# EasyEDA Pro project EverythingBoard.epro

# Schematic Schematic1
Board Name: Board1; Create Date: 2025-08-05; Page Name: P1; Project Name: "Everything Board" [YTK-DE1]; Schematic Name: Schematic1; Update Date: 2025-08-04; Company: EasyEDA.com; Page Size: A4; Version: V1.0
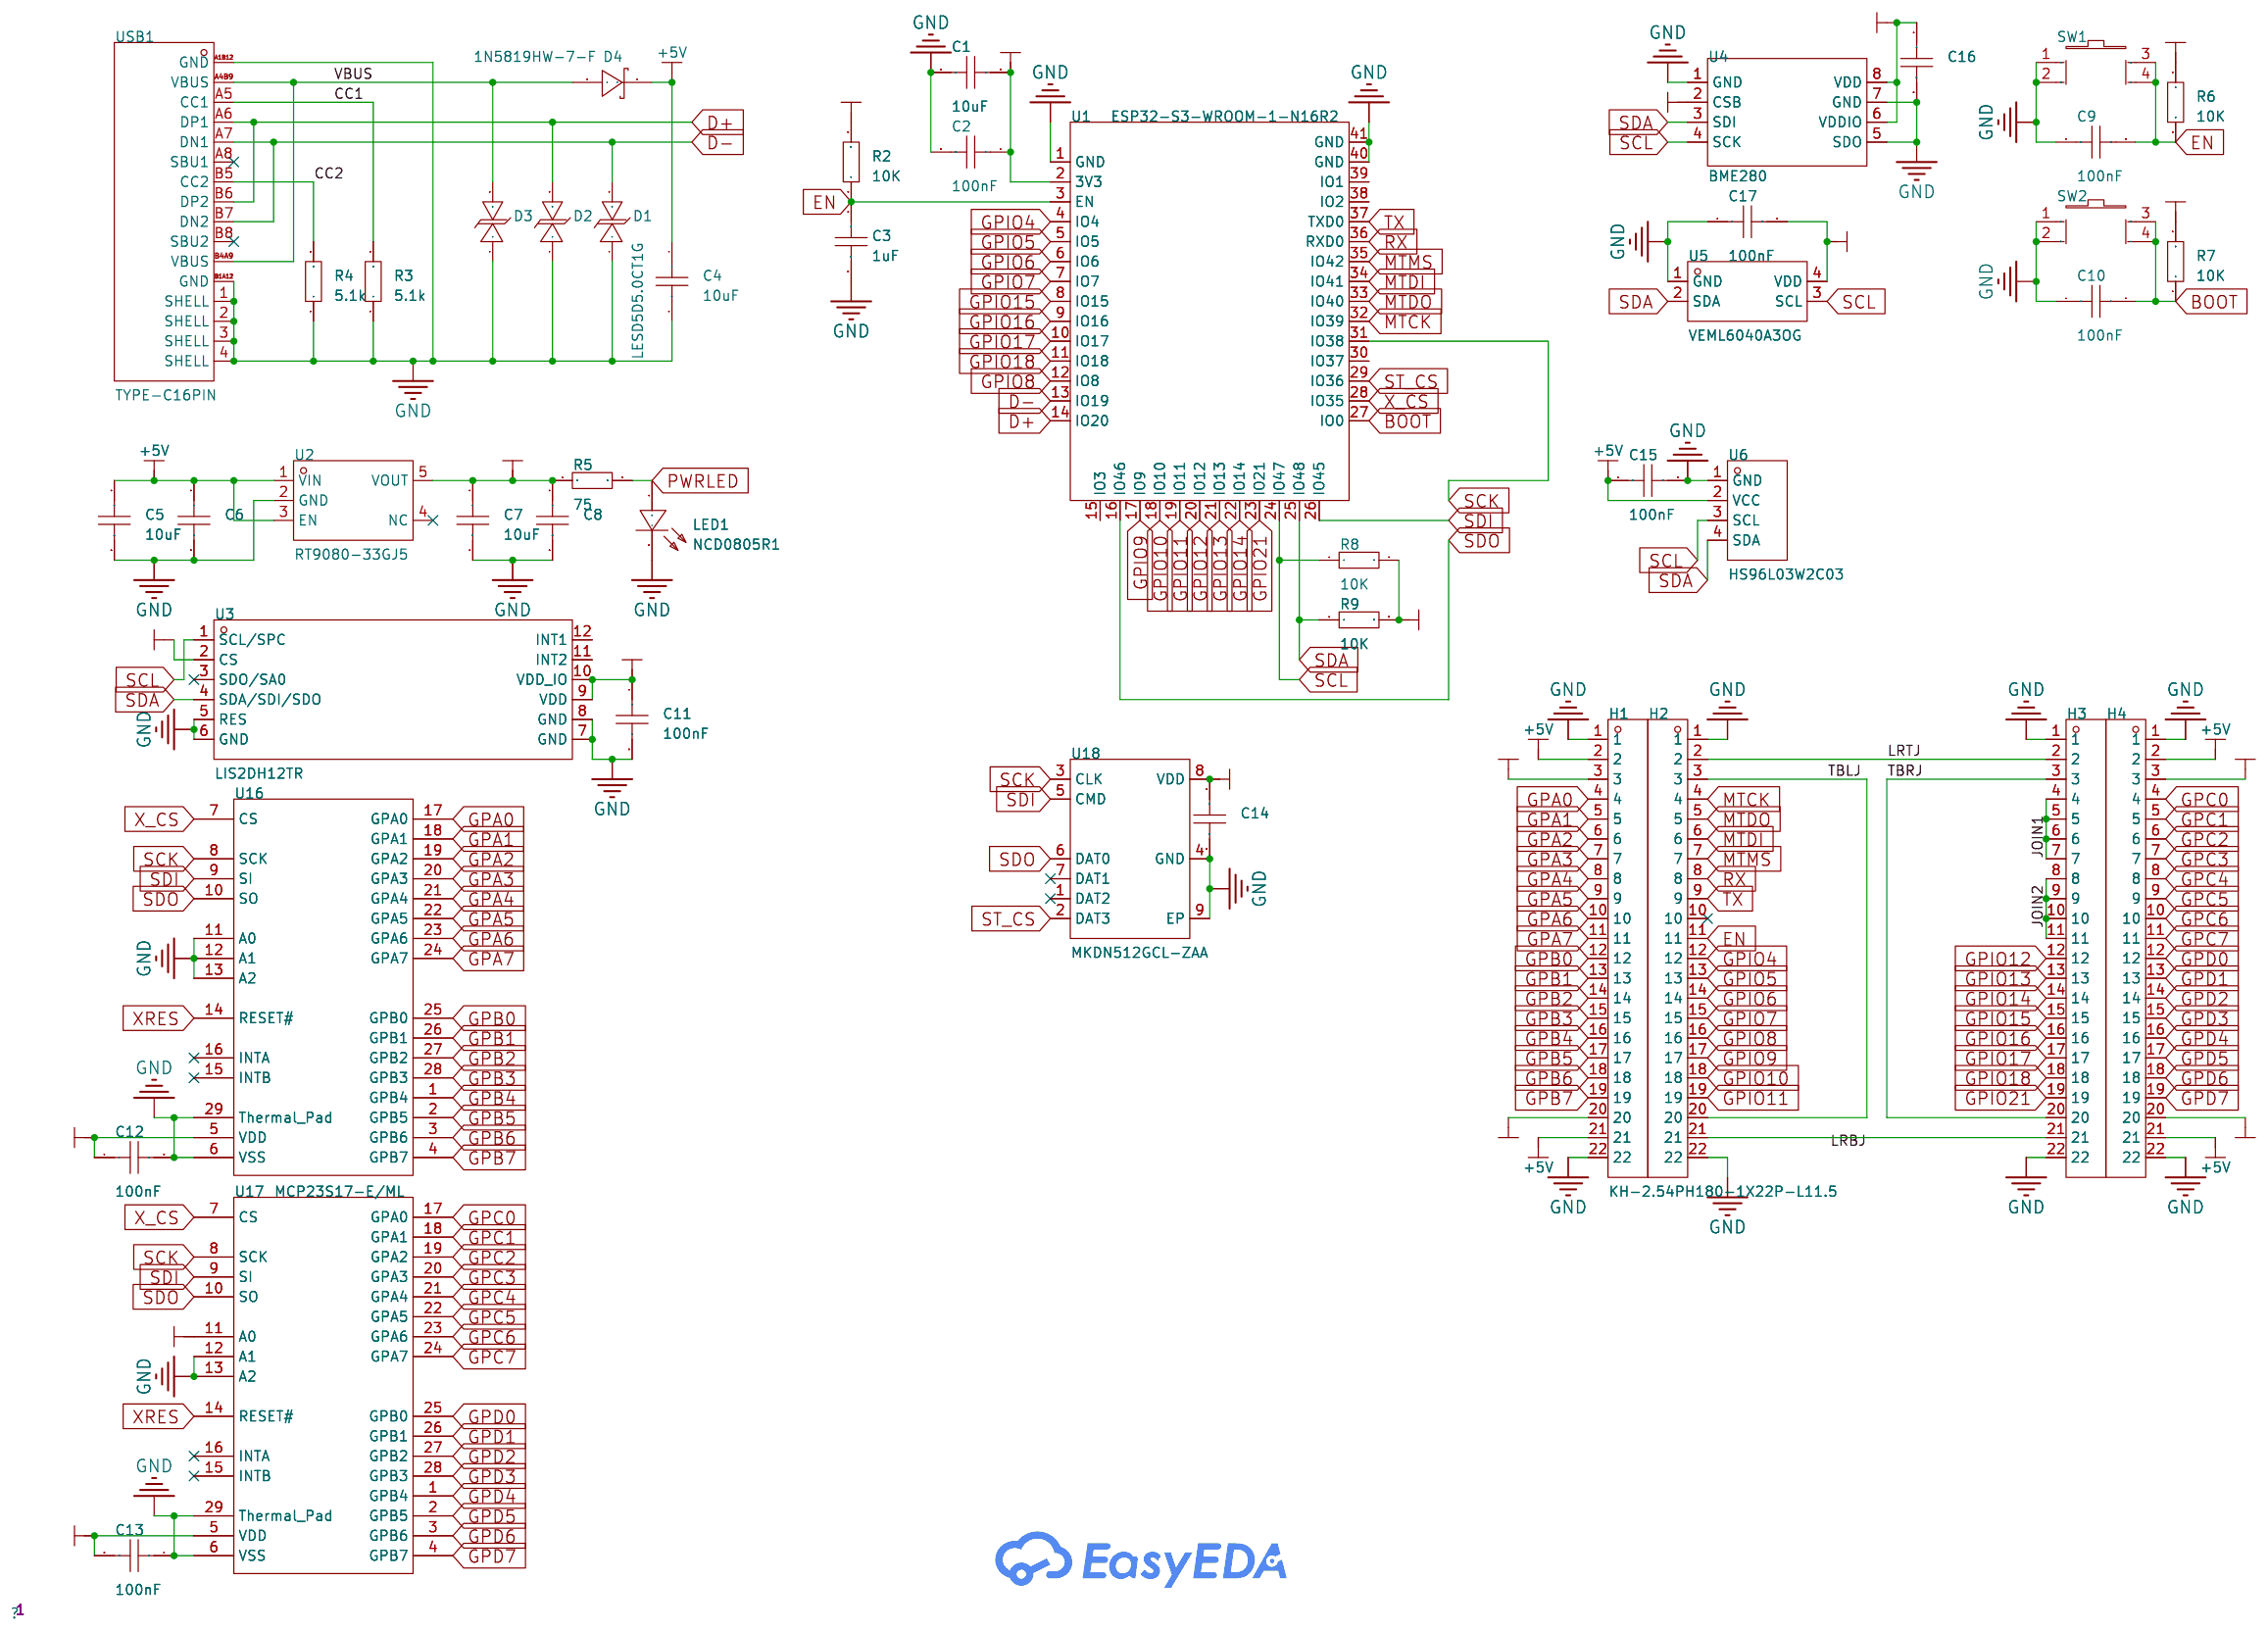
[diagram p0: schematic sheet]

## Parts
C1  10uF  [C0603]
C2  100nF  [C0603]
C3  1uF  [C0603]
C4  10uF  [C0603]
C5  10uF  [C0603]
C6  100nF  [C0603]
C7  10uF  [C0603]
C8  100nF  [C0603]
C9  100nF  [C0603]
C10  100nF  [C0603]
C11  100nF  [C0603]
C12  100nF  [C0603]
C13  100nF  [C0603]
C14  100nF  [C0603]
C15  100nF  [C0603]
C16  100nF  [C0603]
C17  100nF  [C0603]
D1  LESD5D5.0CT1G  [SOD-523_L1.2-W0.8-LS1.6-BI]
D2  LESD5D5.0CT1G  [SOD-523_L1.2-W0.8-LS1.6-BI]
D3  LESD5D5.0CT1G  [SOD-523_L1.2-W0.8-LS1.6-BI]
D4  1N5819HW-7-F  [SOD-123_L2.7-W1.6-LS3.7-RD]
H1  KH-2.54PH180-1X22P-L11.5  [HDR-TH_22P-P2.54-V-M]
H2  KH-2.54PH180-1X22P-L11.5  [HDR-TH_22P-P2.54-V-M]
H3  KH-2.54PH180-1X22P-L11.5  [HDR-TH_22P-P2.54-V-M]
H4  KH-2.54PH180-1X22P-L11.5  [HDR-TH_22P-P2.54-V-M]
LED1  NCD0805R1  [LED0805-R-RD]
R2  10K  [R0603]
R3  5.1k  [R0603]
R4  5.1k  [R0603]
R5  75  [R0603]
R6  10K  [R0603]
R7  10K  [R0603]
R8  10K  [R0603]
R9  10K  [R0603]
SW1  PTS810SJG250SMTRLFS  [SW-SMD_4P_PTS810SJM250SMTRLFS]
SW2  PTS810SJG250SMTRLFS  [SW-SMD_4P_PTS810SJM250SMTRLFS]
U1  ESP32-S3-WROOM-1-N16R2  [WIRELM-SMD_ESP32-S3-WROOM-1]
U2  RT9080-33GJ5  [TSOT-23-5_L2.9-W1.6-P0.95-LS2.8-BL]
U3  LIS2DH12TR  [LGA-12_L2.0-W2.0-P0.50-BL]
U4  BME280  [LGA-8_BME280_BL]
U5  VEML6040A3OG  [SENSOR_SMD_VEML6040A3OG]
U6  HS96L03W2C03  [OLED-TH_L27.8-W27.2-P2.54_C9900033791]
U16  MCP23S17-E/ML  [QFN-28_L6.0-W6.0-P0.65-BL-EP]
U17  MCP23S17-E/ML  [QFN-28_L6.0-W6.0-P0.65-BL-EP]
U18  MKDN512GCL-ZAA  [LGA-16_L12.5-W9.0-P1.27-TL-EP]
USB1  TYPE-C16PIN  [USB-C-SMD_TYPE-C16PIN]

## Library data of the parts
C1-C17 = CAP_0603: Supplier Footprint: 0603
D1-D3 = LESD5D5.0CT1G_C5199850: Supplier Part: C5199850; Manufacturer: UMW(友台半导体); Supplier Footprint: SOD-523; JLCPCB Part Class: Extended Part; Datasheet: https://atta.szlcsc.com/upload/public/pdf/source/20231109/3A3F4A5EA6FBA8B622F70BA286F4E0C0.pdf; Supplier: LCSC
D4 = 1N5819HW-7-F: Forward Voltage (Vf@If):450mV@1A Reverse Voltage (Vr):40V Rectified Current:1A Reverse Leakage Current (Ir):1mA@40V; LCSC Part Name: 电压:40V 电流:1A; Supplier Part: C82544; Manufacturer: DIODES(美台); Supplier Footprint: SOD-123; JLCPCB Part Class: Extended Part; Datasheet: https://atta.szlcsc.com/upload/public/pdf/source/20161024/1477288459223.pdf; Supplier: LCSC; Forward Voltage (Vf@If): 450mV@1A; Reverse Voltage (Vr): 40V; Rectified Current: 1A; Reverse Leakage Current (Ir): 1mA@40V
H1-H4 = KH-2.54PH180-1X22P-L11.5: Pin Structure:1x22P Pitch:2.54mm Number of Rows:Single Row; LCSC Part Name: 1x22P 间距:2.54mm; Supplier Part: C20610289; Manufacturer: kinghelm(金航标); Supplier Footprint: 插件,P=2.54mm; JLCPCB Part Class: Extended Part; Datasheet: https://atta.szlcsc.com/upload/public/pdf/source/20240117/4D3622A7E89961A992C721F36FCFC9FD.pdf; Supplier: LCSC; Pin Structure: 1x22P; Pitch: 2.54mm; Number of Rows: Single Row
LED1 = NCD0805R1_C84256: Lamp Holder Type:- Emitted Color:Red Forward Voltage (VF):1.6V~2.6V Forward Voltage (VF):1.6V~2.6V Power Dissipation:65mW Forward Current:20mA Dominant Wavelength:615nm~630nm Dominant Wavelength:615nm~630nm Peak Wavelength:- Diode Configuration:独立二极管 Lens; Supplier Part: C84256; Manufacturer: 国星光电; Supplier Footprint: 0805; JLCPCB Part Class: Basic Part; Datasheet: https://atta.szlcsc.com/upload/public/pdf/source/20200820/C84256_F0A75A43B3EAD75808600A0514C76B99.pdf; Supplier: LCSC; Emitted Color: Red; Forward Voltage (VF): 1.6V~2.6V; Power Dissipation: 65mW; Forward Current: 20mA; Dominant Wavelength: 615nm~630nm; Diode Configuration: 独立二极管; Lens Color: 无色透明透镜; Luminous Intensity: 67mcd~195mcd; Viewing Angle: 130°; Operating Temperature: -30℃~+85℃
R2-R9 = Res_0603: Supplier Footprint: 0603
SW1 SW2 = PTS810SJG250SMTRLFS: Circuit:SPST Actuator Style:Round Button Operating Force:400gf Mounting Style:Standing paste Switch Length:4.2mm Switch Width:3.2mm Switch Height:2.5mm Contact Current:50mA Voltage Rating (DC):16V With Lamp:- Pin Style:J-pin Mechanical Life:- Operating Te; LCSC Part Name: 轻触开关4.2mm*3.2mm，400gf; Supplier Part: C221895; Manufacturer: C&K; Supplier Footprint: SMD-4P,3.2x4.2mm; JLCPCB Part Class: Extended Part; Datasheet: https://atta.szlcsc.com/upload/public/pdf/source/20180613/C221897_9316320DEFA4333FA0E6C5D565B0D5EA.pdf; Supplier: LCSC; Circuit: SPST; Actuator Style: Round Button; Operating Force: 400gf; Mounting Style: Standing paste; Switch Length: 4.2mm; Switch Width: 3.2mm; Switch Height: 2.5mm; Contact Current: 50mA; Voltage Rating (DC): 16V; Pin Style: J-pin; Operating Temperature: -40℃~+85℃
U1 = ESP32-S3-WROOM-1-N16R2: LCSC Part Name: 通用型Wi-Fi+低功耗蓝牙MCU模组; Supplier Part: C2913205; Manufacturer: ESPRESSIF(乐鑫); Supplier Footprint: SMD,18x25.5mm; JLCPCB Part Class: Extended Part; Datasheet: https://atta.szlcsc.com/upload/public/pdf/source/20220628/A2AC12B3C87735CAEB7EBE2DBE80936C.pdf; Supplier: LCSC
U2 = RT9080-33GJ5: +3V3; Supplier Part: C841192; Manufacturer: RICHTEK(立锜); Supplier Footprint: TSOT-23-5; JLCPCB Part Class: Extended Part; Datasheet: SDA; Supplier: LCSC; Output Type: Fixed; Maximum Input Voltage: 5.5V; Output Voltage: +3V3; Output Current: 600mA; Power Supply Rejection Ratio (PSRR): 75dB@(1kHz); Dropout Voltage: 530mV@(600mA); standby current: 4uA; Feature: ESD Protection；Thermal Protection(TSD)；Overcurrent Protection(OCP)；With ability; Operating Temperature: -40℃~+85℃@(Ta); Output Polarity: Positive electrode; Number of Outputs: 1
U3 = LIS2DH12TR: Axial Direction:X,Y,Z Supply Voltage:1.71V~3.6V Supply Voltage:1.71V~3.6V Operating Temperature:-40℃~+85℃ Operating Temperature:-40℃~+85℃; Supplier Part: C110926; Manufacturer: ST(意法半导体); Supplier Footprint: LGA-12(2x2); JLCPCB Part Class: Extended Part; Datasheet: https://atta.szlcsc.com/upload/public/pdf/source/20171014/C110926_15079752606891037920.pdf; Supplier: LCSC; Axial Direction: X,Y,Z; Supply Voltage: 1.71V~3.6V; Operating Temperature: -40℃~+85℃
U4 = BME280: Voltage - Supply:1.71V~3.6V Voltage - Supply:1.71V~3.6V; LCSC Part Name: 湿度：0%RH~100%RH; Supplier Part: C92489; Manufacturer: Bosch(博世); Supplier Footprint: LGA-8(2.5x2.5); JLCPCB Part Class: Extended Part; Datasheet: https://atta.szlcsc.com/upload/public/pdf/source/20230217/9358ECB1DA7C52D8F39392648E599102.pdf; Supplier: LCSC; Voltage - Supply: 1.71V~3.6V
U5 = VEML6040A3OG: Detection color:Red,Green,Blue,White Interface Type:I2C Supply Voltage:2.5V~3.6V Supply Voltage:2.5V~3.6V Resolution:- Quiescent Current (Iq):- Operating Temperature:-40℃~+85℃ Operating Temperature:-40℃~+85℃; Supplier Part: C78465; Manufacturer: VISHAY(威世); Supplier Footprint: OPLGA-4(1.3x2); JLCPCB Part Class: Extended Part; Datasheet: https://atta.szlcsc.com/upload/public/pdf/source/20180511/C78465_1ECCD5CBB0DFD90660DF8047804D95FA.pdf; Supplier: LCSC; Detection color: Red,Green,Blue,White; Interface Type: I2C; Supply Voltage: 2.5V~3.6V; Operating Temperature: -40℃~+85℃
U6 = HS96L03W2C03: Main Control Chip:SSD1315 Interface Type:I2C Size:0.96 Pixel Resolution:128x64 Operating Temperature:-40℃~+70℃ Operating Temperature:-40℃~+70℃; LCSC Part Name: 0.96寸OLED显示屏窄白光IIC; Supplier Part: C5248080; Manufacturer: HS(汉昇); JLCPCB Part Class: Extended Part; Datasheet: https://atta.szlcsc.com/upload/public/pdf/source/20230627/763D01F79A90007632F098068C7C8AD9.pdf; Supplier: LCSC; Main Control Chip: SSD1315; Interface Type: I2C; Size: 0.96; Pixel Resolution: 128x64; Operating Temperature: -40℃~+70℃
U16 U17 = MCP23S17-E/ML: Interface:SPI Number of I/O:16 Interrupt Output:With Interrupt Output Output Type:- Voltage - Supply:1.8V~5.5V Voltage - Supply:1.8V~5.5V Current - Output Low(IOL):- Current - Output High(IOH):- Clock Frequency:10MHz Operating Temperature:-40℃~+125℃ Opera; Supplier Part: C147896; Manufacturer: MICROCHIP(美国微芯); Supplier Footprint: QFN-28-EP(6x6); JLCPCB Part Class: Extended Part; Datasheet: https://atta.szlcsc.com/upload/public/pdf/source/20171120/C148096_15111748815831131858.pdf; Supplier: LCSC; Interface: SPI; Number of I/O: 16; Interrupt Output: With Interrupt Output; Voltage - Supply: 1.8V~5.5V; Clock Frequency: 10MHz; Operating Temperature: -40℃~+125℃
U18 = MKDN512GCL-ZAA: Memory Size:512Gbit Clock Frequency:208MHz Voltage - Supply:2.7V~3.6V Voltage - Supply:2.7V~3.6V Write Cycle Time(tWC):- Page Program time (TPP):- Block Erase Time(tBE):- Data Retention - TDR (Year):- Operating Temperature:-25℃~+85℃ Operating Temperature:; LCSC Part Name: 512Gb SD NAND 商业级SDNAND; Supplier Part: C17700147; Manufacturer: MK(米客方德); Supplier Footprint: LGA-16(9x12.5); JLCPCB Part Class: Extended Part; Datasheet: https://atta.szlcsc.com/upload/public/pdf/source/20230912/61DE496B9367E626E96A5C5416BBF249.pdf; Supplier: LCSC; Memory Size: 512Gbit; Clock Frequency: 208MHz; Voltage - Supply: 2.7V~3.6V; Operating Temperature: -25℃~+85℃; Interface: SD3.0
USB1 = TYPE-C16PIN: Connector Type:Type-C Protocol Standard:USB 3.1 Gender:Female Mounting Type:Surface Mount, Right Angle Number of Contacts:16P Number of Ports:1 Current Rating-Power:3A Voltage Rating:30V Connect-Disconnect Life:10,000 Cycles Detection color:Black Operatin; LCSC Part Name: Type-C 母 卧贴; Supplier Part: C393939; Manufacturer: SHOU HAN(首韩); Supplier Footprint: SMD; JLCPCB Part Class: Extended Part; Datasheet: https://atta.szlcsc.com/upload/public/pdf/source/20250618/9FBF2A26CFCE0E69298FA0B726710E9E.pdf; Supplier: LCSC; Connector Type: Type-C; Protocol Standard: USB 3.1; Gender: Female; Mounting Type: Surface Mount, Right Angle; Number of Contacts: 16P; Number of Ports: 1; Current Rating-Power: 3A; Voltage Rating: 30V; Connect-Disconnect Life: 10,000 Cycles; Detection color: Black; Operating Temperature: -40℃~+85℃

## Nets
+3V3: C1.1 C2.1 C7.1 C8.1 C11.1 C12.1 C13.2 C14.1 C16.1 C17.2 H1.3 H1.20 H4.3 H4.20 R2.2 R5.1 R6.1 R7.2 R8.2 R9.2 U1.2(3V3) U2.5(VOUT) U3.2(CS) U3.9(VDD) U3.10(VDD_IO) U4.2(CSB) U4.6(VDDIO) U4.8(VDD) U5.4(VDD) U16.5(VDD) U17.5(VDD) U17.11(A0) U18.8(VDD)
+5V: C4.1 C5.1 C6.1 C15.1 D4.1(K) H1.2 H1.21 H4.2 H4.21 U2.1(VIN) U2.3(EN) U6.2(VCC)
GND: C1.2 C2.2 C3.2 C4.2 C5.2 C6.2 C7.2 C8.2 C9.1 C10.1 C11.2 C12.2 C13.1 C14.2 C15.2 C16.2 C17.1 D1.1 D2.1 D3.1 H1.1 H1.22 H2.1 H2.22 H3.1 H3.22 H4.1 H4.22 LED1.2(-) R3.1 R4.1 SW1.1 SW1.2 SW2.1 SW2.2 U1.1(GND) U1.40(GND) U1.41(GND) U2.2(GND) U3.5(RES) U3.6(GND) U3.7(GND) U3.8(GND) U4.1(GND) U4.5(SDO) U4.7(GND) U5.1(GND) U6.1(GND) U16.6(VSS) U16.11(A0) U16.12(A1) U16.13(A2) U16.29(Thermal Pad) U17.6(VSS) U17.12(A1) U17.13(A2) U17.29(Thermal Pad) U18.4(GND) U18.9(EP) USB1.1(SHELL) USB1.2(SHELL) USB1.3(SHELL) USB1.4(SHELL) USB1.A1B12(GND) USB1.B1A12(GND)
VBUS: D3.2 D4.2(A) USB1.A4B9(VBUS) USB1.B4A9(VBUS)
BOOT: C10.2 R7.1 SW2.3 SW2.4 U1.27(IO0)
CC1: R3.2 USB1.A5(CC1)
CC2: R4.2 USB1.B5(CC2)
D+: D2.2 U1.14(IO20) USB1.A6(DP1) USB1.B6(DP2)
D-: D1.2 U1.13(IO19) USB1.A7(DN1) USB1.B7(DN2)
EN: C3.1 C9.2 H2.11 R2.1 R6.2 SW1.3 SW1.4 U1.3(EN)
GPA0: H1.4 U16.17(GPA0)
GPA1: H1.5 U16.18(GPA1)
GPA2: H1.6 U16.19(GPA2)
GPA3: H1.7 U16.20(GPA3)
GPA4: H1.8 U16.21(GPA4)
GPA5: H1.9 U16.22(GPA5)
GPA6: H1.10 U16.23(GPA6)
GPA7: H1.11 U16.24(GPA7)
GPB0: H1.12 U16.25(GPB0)
GPB1: H1.13 U16.26(GPB1)
GPB2: H1.14 U16.27(GPB2)
GPB3: H1.15 U16.28(GPB3)
GPB4: H1.16 U16.1(GPB4)
GPB5: H1.17 U16.2(GPB5)
GPB6: H1.18 U16.3(GPB6)
GPB7: H1.19 U16.4(GPB7)
GPC0: H4.4 U17.17(GPA0)
GPC1: H4.5 U17.18(GPA1)
GPC2: H4.6 U17.19(GPA2)
GPC3: H4.7 U17.20(GPA3)
GPC4: H4.8 U17.21(GPA4)
GPC5: H4.9 U17.22(GPA5)
GPC6: H4.10 U17.23(GPA6)
GPC7: H4.11 U17.24(GPA7)
GPD0: H4.12 U17.25(GPB0)
GPD1: H4.13 U17.26(GPB1)
GPD2: H4.14 U17.27(GPB2)
GPD3: H4.15 U17.28(GPB3)
GPD4: H4.16 U17.1(GPB4)
GPD5: H4.17 U17.2(GPB5)
GPD6: H4.18 U17.3(GPB6)
GPD7: H4.19 U17.4(GPB7)
GPIO4: H2.12 U1.4(IO4)
GPIO5: H2.13 U1.5(IO5)
GPIO6: H2.14 U1.6(IO6)
GPIO7: H2.15 U1.7(IO7)
GPIO8: H2.16 U1.12(IO8)
GPIO9: H2.17 U1.17(IO9)
GPIO10: H2.18 U1.18(IO10)
GPIO11: H2.19 U1.19(IO11)
GPIO12: H3.12 U1.20(IO12)
GPIO13: H3.13 U1.21(IO13)
GPIO14: H3.14 U1.22(IO14)
GPIO15: H3.15 U1.8(IO15)
GPIO16: H3.16 U1.9(IO16)
GPIO17: H3.17 U1.10(IO17)
GPIO18: H3.18 U1.11(IO18)
GPIO21: H3.19 U1.23(IO21)
JOIN1: H3.4 H3.5 H3.6 H3.7
JOIN2: H3.8 H3.9 H3.10 H3.11
LRBJ: H2.21 H3.21
LRTJ: H2.2 H3.2
MTCK: H2.4 U1.32(IO39)
MTDI: H2.6 U1.34(IO41)
MTDO: H2.5 U1.33(IO40)
MTMS: H2.7 U1.35(IO42)
PWRLED: LED1.1(+) R5.2
RX: H2.8 U1.36(RXD0)
SCK: U1.31(IO38) U16.8(SCK) U17.8(SCK) U18.3(CLK)
SCL: R8.1 U1.24(IO47) U3.1(SCL/SPC) U4.4(SCK) U5.3(SCL) U6.3(SCL)
SDA: R9.1 U1.25(IO48) U3.4(SDA/SDI/SDO) U4.3(SDI) U5.2(SDA) U6.4(SDA)
SDI: U1.26(IO45) U16.9(SI) U17.9(SI) U18.5(CMD)
SDO: U1.16(IO46) U16.10(SO) U17.10(SO) U18.6(DAT0)
ST_CS: U1.29(IO36) U18.2(DAT3)
TBLJ: H2.3 H2.20
TBRJ: H3.3 H3.20
TX: H2.9 U1.37(TXD0)
X_CS: U1.28(IO35) U16.7(CS) U17.7(CS)
XRES: U16.14(RESET#) U17.14(RESET#)

Not connected (* = marked no-connect by the designer): H2 10*; U1 15(IO3) 30(IO37) 38(IO2) 39(IO1); U2 4(NC)*; U3 3(SDO/SA0)* 11(INT2) 12(INT1); U16 15(INTB)* 16(INTA)*; U17 15(INTB)* 16(INTA)*; U18 1(DAT2)* 7(DAT1)*; USB1 A8(SBU1)* B8(SBU2)*

# Board PCB1
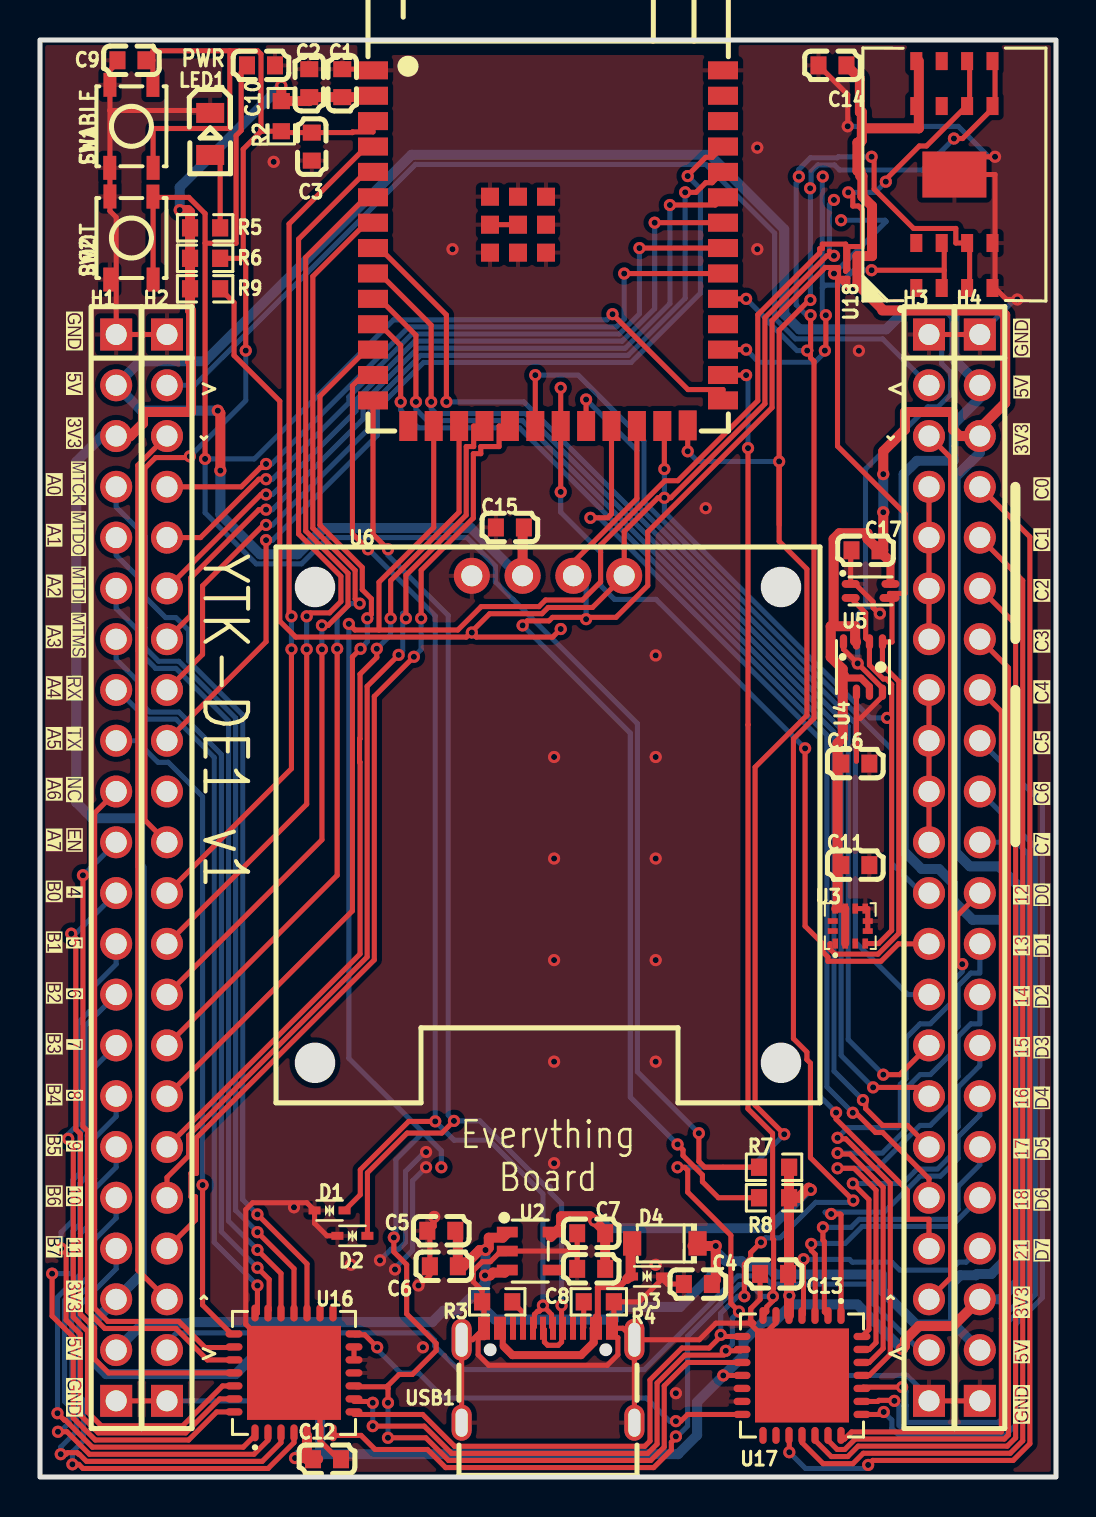
[diagram p1: board, top side]
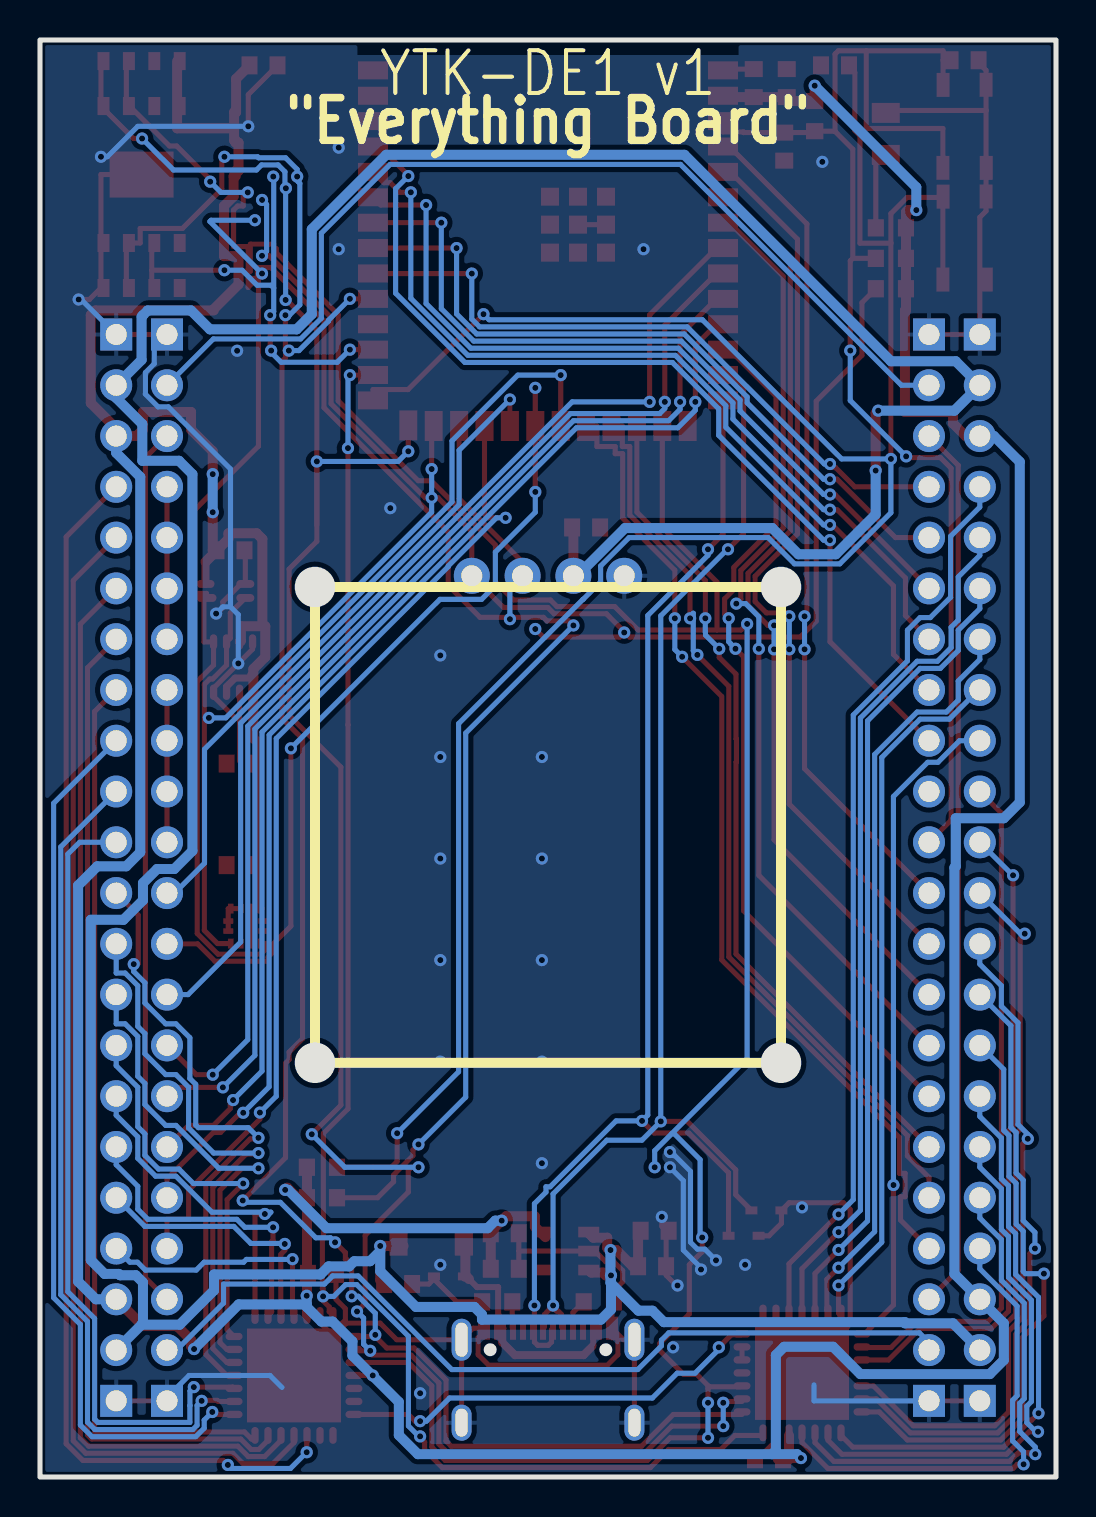
[diagram p2: board, bottom side, seen from below]

Outline 50.8 x 71.88 mm; copper layers: Top Layer, Bottom Layer. Coordinates in mm from the lower left corner of the outline.
Outline path: rectangle 0,71.88 50.8,0
Stack: Top Layer 0.035mm / Dielectric1 1.51mm FR4 er 4.5 / Bottom Layer 0.035mm

## Design rules (mm)
template: JLCPCB Capability(Two Layers Board)
spacing copperThickness1oz (default): track to track 0.102, other pairs 0.152 to 0.3
spacing copperThickness2oz: track to track 0.203, other pairs 0.152 to 0.3
track width copperThickness1oz (default): min 0.127, default 0.254, max 2.54
track width copperThickness2oz: min 0.203, default 0.254, max 2.54
differential pair differentialPair (default): width min 0.127, default 0.254, max 2.54; gap min 0.152, default 0.152
via viaSize (default): diameter min 0.5, default 0.61, max 10; hole min 0.3, default 0.305, max 6.3

## Placement (name value [footprint] x y rotation side)
C1  10uF  [C0603]  15.11 69.72 90 top
C2  100nF  [C0603]  13.46 69.72 90 top
C3  1uF  [C0603]  13.59 66.55 270 top
C4  10uF  [C0603]  32.89 9.65 180 top
C5  10uF  [C0603]  20.07 12.32 180 top
C6  100nF  [C0603]  20.19 10.54 180 top
C7  10uF  [C0603]  27.56 12.19 180 top
C8  100nF  [C0603]  27.56 10.41 180 top
C9  100nF  [C0603]  4.57 70.87 0 top
C10  100nF  [C0603]  11.05 70.61 180 top
C11  100nF  [C0603]  40.77 30.61 0 top
C12  100nF  [C0603]  14.35 0.89 0 top
C13  100nF  [C0603]  36.7 10.16 0 top
C14  100nF  [C0603]  39.62 70.61 180 top
C15  100nF  [C0603]  23.5 47.5 180 top
C16  100nF  [C0603]  40.77 35.69 0 top
C17  100nF  [C0603]  41.28 46.36 0 top
D1  LESD5D5.0CT1G  [SOD-523_L1.2-W0.8-LS1.6-BI]  14.48 13.34 0 top
D2  LESD5D5.0CT1G  [SOD-523_L1.2-W0.8-LS1.6-BI]  15.62 12.07 0 top
D3  LESD5D5.0CT1G  [SOD-523_L1.2-W0.8-LS1.6-BI]  30.35 10.03 180 top
D4  1N5819HW-7-F  [SOD-123_L2.7-W1.6-LS3.7-RD]  31.24 11.68 180 top
H1  KH-2.54PH180-1X22P-L11.5  [HDR-TH_22P-P2.54-V-M]  3.81 30.48 270 top
H2  KH-2.54PH180-1X22P-L11.5  [HDR-TH_22P-P2.54-V-M]  6.35 30.48 270 top
H3  KH-2.54PH180-1X22P-L11.5  [HDR-TH_22P-P2.54-V-M]  44.45 30.48 270 top
H4  KH-2.54PH180-1X22P-L11.5  [HDR-TH_22P-P2.54-V-M]  46.99 30.48 270 top
LED1  NCD0805R1  [LED0805-R-RD]  8.51 67.18 270 top
R2  10K  [R0603]  12.06 68.07 90 top
R3  5.1k  [R0603]  22.86 8.76 0 top
R4  5.1k  [R0603]  27.94 8.76 180 top
R5  75  [R0603]  8.25 62.48 0 top
R6  10K  [R0603]  8.25 60.96 0 top
R7  10K  [R0603]  36.7 15.49 0 top
R8  10K  [R0603]  36.7 13.97 0 top
R9  10K  [R0603]  8.25 59.44 180 top
SW1  PTS810SJG250SMTRLFS  [SW-SMD_4P_PTS810SJM250SMTRLFS]  4.57 67.56 90 top
SW2  PTS810SJG250SMTRLFS  [SW-SMD_4P_PTS810SJM250SMTRLFS]  4.57 61.98 90 top
U1  ESP32-S3-WROOM-1-N16R2  [WIRELM-SMD_ESP32-S3-WROOM-1]  25.4 61.47 0 top
U2  RT9080-33GJ5  [TSOT-23-5_L2.9-W1.6-P0.95-LS2.8-BL]  24.51 11.3 270 top
U3  LIS2DH12TR  [LGA-12_L2.0-W2.0-P0.50-BL]  40.51 27.56 0 top
U4  BME280  [LGA-8_BME280_BL]  41.15 40.51 90 top
U5  VEML6040A3OG  [SENSOR_SMD_VEML6040A3OG]  41.53 44.32 90 top
U6  HS96L03W2C03  [OLED-TH_L27.8-W27.2-P2.54_C9900033791]  25.4 45.08 0 top
U16  MCP23S17-E/ML  [QFN-28_L6.0-W6.0-P0.65-BL-EP]  12.7 5.21 0 top
U17  MCP23S17-E/ML  [QFN-28_L6.0-W6.0-P0.65-BL-EP]  38.1 5.08 180 top
U18  MKDN512GCL-ZAA  [LGA-16_L12.5-W9.0-P1.27-TL-EP]  45.72 65.15 90 top
USB1  TYPE-C16PIN  [USB-C-SMD_TYPE-C16PIN]  25.4 5.08 0 top

## Footprints (pads in the part's own frame, mm; a bottom-side part is the same pattern mirrored in y, then rotated)
C0603
  rect 0.8x0.9 smd: 1(-0.7,0) 2(0.7,0)
HDR-TH_22P-P2.54-V-M
  rect 1.6x1.6 hole 1.05: 1(-26.67,0) 22(26.67,0)
  round 1.6 hole 1.05: 2(-24.13,0) 3(-21.59,0) 4(-19.05,0) 5(-16.51,0) 6(-13.97,0) 7(-11.43,0) 8(-8.89,0) 9(-6.35,0) 10(-3.81,0) 11(-1.27,0) 12(1.27,0) 13(3.81,0) 14(6.35,0) 15(8.89,0) 16(11.43,0) 17(13.97,0) 18(16.51,0) 19(19.05,0) 20(21.59,0) 21(24.13,0)
LED0805-R-RD
  rect 1x1.399 smd: 1(1.05,0) 2(-1.05,0)
LGA-8_BME280_BL
  oval 0.767x0.364 smd: 1(1.258,0.975) 2(1.258,0.325) 3(1.258,-0.325) 4(1.258,-0.975) 5(-1.258,-0.975) 6(-1.258,-0.325) 7(-1.258,0.325) 8(-1.258,0.975)
LGA-12_L2.0-W2.0-P0.50-BL
  rect 0.28x0.5 smd: 1(-0.75,-0.875) 2(-0.25,-0.875) 3(0.25,-0.875) 4(0.75,-0.875) 7(0.75,0.875) 8(0.25,0.875) 9(-0.25,0.875) 10(-0.75,0.875)
  rect 0.5x0.28 smd: 5(0.875,-0.25) 6(0.875,0.25) 11(-0.875,0.25) 12(-0.875,-0.25)
LGA-16_L12.5-W9.0-P1.27-TL-EP
  rect 0.9x0.6 smd: 1(-5.675,1.905) 1(-3.425,1.905) 2(-5.675,0.635) 2(-3.425,0.635) 3(-5.675,-0.635) 3(-3.425,-0.635) 4(-5.675,-1.905) 4(-3.425,-1.905) 5(3.425,-1.905) 5(5.675,-1.905) 6(3.425,-0.635) 6(5.675,-0.635) 7(3.425,0.635) 7(5.675,0.635) 8(3.425,1.905) 8(5.675,1.905)
  rect 2.3x3.2 smd: 9(0,0)
OLED-TH_L27.8-W27.2-P2.54_C9900033791
  round 1.8 hole 1.05: 1(-3.81,0) 2(-1.27,0) 3(1.27,0) 4(3.81,0)
QFN-28_L6.0-W6.0-P0.65-BL-EP
  oval 0.364x0.847 smd: 1(-1.95,-2.998) 2(-1.3,-2.998) 3(-0.65,-2.998) 4(0,-2.998) 5(0.65,-2.998) 6(1.3,-2.998) 7(1.95,-2.998) 15(1.95,2.998) 16(1.3,2.998) 17(0.65,2.998) 18(0,2.998) 19(-0.65,2.998) 20(-1.3,2.998) 21(-1.95,2.998)
  oval 0.847x0.364 smd: 8(2.998,-1.95) 9(2.998,-1.3) 10(2.998,-0.65) 11(2.998,0) 12(2.998,0.65) 13(2.998,1.3) 14(2.998,1.95) 22(-2.998,1.95) 23(-2.998,1.3) 24(-2.998,0.65) 25(-2.998,0) 26(-2.998,-0.65) 27(-2.998,-1.3) 28(-2.998,-1.95)
  rect 4.7x4.7 smd: 29(0,0)
R0603
  rect 0.806x0.864 smd: 1(-0.753,0) 2(0.753,0)
SENSOR_SMD_VEML6040A3OG
  oval 0.392x0.9 smd: 1(0.35,0.996) 2(-0.35,0.996) 4(0.35,-0.996)
  oval 0.392x1 smd: 3(-0.35,-0.946)
SOD-123_L2.7-W1.6-LS3.7-RD
  rect 0.91x1.22 smd: 1(-1.635,0) 2(1.635,0)
SOD-523_L1.2-W0.8-LS1.6-BI
  rect 0.6x0.4 smd: 1(-0.75,0) 2(0.75,0)
SW-SMD_4P_PTS810SJM250SMTRLFS
  rect 1.2x0.65 smd: 1(-2.078,1.083) 2(2.078,1.075) 3(-2.077,-1.083) 4(2.071,-1.075)
TSOT-23-5_L2.9-W1.6-P0.95-LS2.8-BL
  rect 0.532x1.045 smd: 1(-0.95,-1.147) 2(0,-1.147) 3(0.95,-1.147) 4(0.95,1.147) 5(-0.95,1.147)
USB-C-SMD_TYPE-C16PIN
  oval 1x2.1 hole 0.6x1.7: 1(-4.32,1.788) 2(4.32,1.788)
  oval 1x1.8 hole 0.6x1.4: 3(-4.32,-2.362) 4(4.32,-2.362)
  rect 0.6x1.15 smd: A1B12(-3.2,2.362) A4B9(-2.4,2.362) B1A12(3.2,2.362) B4A9(2.4,2.362)
  rect 0.3x1.15 smd: A5(-1.25,2.362) A6(-0.25,2.362) A7(0.25,2.362) A8(1.25,2.362) B5(1.75,2.362) B6(0.75,2.362) B7(-0.75,2.362) B8(-1.75,2.362)
WIRELM-SMD_ESP32-S3-WROOM-1
  rect 1.5x0.9 smd: 1(-8.75,8.895) 2(-8.75,7.625) 3(-8.75,6.355) 4(-8.75,5.085) 5(-8.75,3.815) 6(-8.75,2.545) 7(-8.75,1.275) 8(-8.75,0.005) 9(-8.75,-1.265) 10(-8.75,-2.535) 11(-8.75,-3.805) 12(-8.75,-5.075) 13(-8.75,-6.345) 14(-8.75,-7.615) 27(8.75,-7.615) 28(8.75,-6.345) 29(8.75,-5.075) 30(8.75,-3.805) 31(8.75,-2.535) 32(8.75,-1.265) 33(8.75,0.005) 34(8.75,1.275) 35(8.75,2.545) 36(8.75,3.815) 37(8.75,5.085) 38(8.75,6.355) 39(8.75,7.625) 40(8.75,8.895)
  rect 0.9x1.5 smd: 15(-6.985,-8.895) 16(-5.715,-8.895) 17(-4.445,-8.895) 18(-3.175,-8.895) 19(-1.905,-8.895) 20(-0.635,-8.895) 21(0.635,-8.895) 22(1.905,-8.895) 23(3.175,-8.895) 24(4.445,-8.895) 25(5.715,-8.895) 26(6.985,-8.865)
  rect 0.9x0.9 smd: 41(-2.9,2.575) 41(-2.9,1.175) 41(-2.9,-0.225) 41(-1.5,2.575) 41(-1.5,1.175) 41(-1.5,-0.225) 41(-0.1,2.575) 41(-0.1,1.175) 41(-0.1,-0.225)

## Nets
As in the schematic.

Pads without a net: H2 10; U1 15 30 38 39; U2 4; U3 3 11 12; U16 15 16; U17 15 16; U18 1 7; USB1 A8 B8

## Via types
v1: diameter 0.61, hole 0.305, Top Layer to Bottom Layer, 180 vias

## Routing (per net, layer and track width the routed paths; a pad name or vN(x,y) marks a point on that pad's centre or on a via; arc(x,y) is an arc through that point)
+3V3: length 291.4
  Top Layer w0.254: U17.11 v1(34.16,5.08)
  Top Layer w0.35: U4.6 41.47,39.54 41.04,39.97 40.25,39.97 40.25,40.14 40.13,40.02
  Top Layer w0.4: 40.08,28.43 U3.10 ; U3.9 40.26,28.43 40.26,26.68 ; 42.52,45.78 U5.4
  Top Layer w0.5: 39.88,28.5 39.88,36.7 40.14,36.96 40.14,39.29 ; 37.45,15.37 U17.5 ; C17.2 42.16,46.36 v1(42.16,48.26) ; 13.35,0.95 13.35,0.89 13.91,0.89 ; 13.35,0.95 v1(12.75,0.95) ; 13.35,0.95 13.35,2.08 ; C14.1 41,69.94 41,68.27 41.09,68.27 41.09,67.46 ; 42.11,58.35 48.03,58.35 48.26,58.13 48.26,53.72 46.99,52.45 H4.3 45.98,52.07 45.65,52.39 45.65,53.27 43.25,53.27 43.25,52.39 42.16,51.31 v1(42.16,50.17) ; 39.68,42.56 39.68,46.92 39.97,47.21 41.38,47.21 41.38,46.92 42.52,45.78 ; v1(6.99,63.37) 7.4,63.37 7.5,63.27 R5.1 ; 7.5,62.36 R6.1 R9.2 7.5,58.35 7.55,58.35 7.55,55.95 7.5,55.95 7.5,55.81 7.55,55.81 7.55,53.27 5.15,53.27 5.15,52.7 4.52,52.07 H1.3 ; 41.09,67.46 41.09,66.86 41.02,66.86 41.02,66.75 40.87,66.75 40.87,65.33 41.02,65.33 41.02,65.07 41.12,65.07 41.12,64.06 41.6,63.57 41.6,61.07 40.87,61.07 40.87,59.66 42.11,58.42 ; 41.09,67.46 43.94,67.46 43.94,70.83 ; v1(12.06,69.6) R2.2 13.46,68.83 C2.1 C1.1 16.65,69.02 U1.2 ; v1(38.54,14.36) 38.43,14.47 37.96,14 37.96,13.97 R8.2 ; 25.53,12 26.06,12.52 26.06,13.04 27.5,13.04 v1(27.72,12.82) 28.26,12.28 28.26,10.41 ; H4.20 45.65,7.55 43.95,7.55 43.25,6.85 43.25,6.55 v1(43.1,6.4) ; 40.81,41.77 40.76,41.82 40.76,42.56 39.54,42.56 39.54,41.01 40.13,40.42 40.13,39.3
  Bottom Layer w0.5: v1(27.72,12.82) 28.04,12.82 28.42,12.45 36.48,12.45 38.39,14.36 v1(38.54,14.36) ; 3.81,52.07 3.1,52.07 1.81,50.78 1.81,33.75 2.61,32.95 5.01,32.95 5.01,30.55 5.08,30.48 5.08,10.16 H1.20 2.61,7.69 2.61,5.85 3.31,5.15 9.78,5.15 11.15,6.51 13.59,6.51 14.01,6.1 14.01,1.33 14.2,1.14 ; 37.47,8.64 40.86,8.64 v1(43.1,6.4) ; 37.47,8.64 37.47,8.51 36.73,7.78 36.17,7.78 35.18,6.78 35.18,6.08 32.86,3.75 32.86,2.09 31.91,1.14 14.2,1.14 ; 37.47,8.64 v1(37.47,9.07) ; 14.2,1.14 12.95,1.14 v1(12.75,0.95) ; v1(42.16,50.17) v1(42.16,48.26) ; v1(12.06,69.6) 6.99,64.52 v1(6.99,63.37) ; H4.20 48.01,8.89 48.9,9.78 48.9,29.59 47.94,30.55 46.49,30.55 45.79,31.25 45.79,50.03 46.99,51.23 H4.3
+5V: length 205.8
  Top Layer w0.5: C15.1 24.13,47.5 U6.2 ; 32.62,11.56 v1(33.79,11.56) 33.79,9.85 C4.1 ; 21.17,10.54 C6.1 20.89,12.07 ; 23.36,10.35 23.24,10.23 22.65,10.23 22.5,10.08 v1(22.25,10.08) ; v1(9.02,50.34) 9.02,53.21 v1(8.89,53.34) ; U2.1 23.36,12.2 23.14,11.97 22.44,11.97 22.44,11.46 22.33,11.35 v1(22.28,11.35) 21.98,11.35 21.17,10.54
  Bottom Layer w0.5: 22.25,9.69 22.28,9.72 v1(22.28,11.35) ; 22.25,9.69 22.25,8.37 22.75,7.87 28.7,7.87 28.7,8.13 29.08,8.51 32,8.51 33.79,10.29 33.79,11.3 ; 22.25,9.69 20.88,8.32 20.18,8.32 19.61,7.75 7.55,7.75 7.55,7.69 5.15,7.69 H1.21 ; 22.25,9.69 v1(22.25,10.08) ; 33.79,11.3 v1(33.79,11.56) ; 33.79,11.3 34.3,10.8 35.09,10.8 35.34,10.54 36.37,10.54 36.77,10.13 42.1,10.13 42.1,9.33 43.81,7.62 45.72,7.62 ; U6.2 23.94,45.08 21.55,47.47 14.19,47.47 12.88,46.16 11.01,46.16 9.02,48.15 v1(9.02,50.34) ; v1(8.89,53.34) 5.08,53.34 H1.2 5.01,55.81 8.25,55.81 18.58,66.14 33.49,66.14 37.21,62.42 37.21,58.17 37.97,57.41 42.3,57.41 43.25,58.35 45.42,58.35 45.65,58.12 45.65,58.11 45.72,58.04 45.72,55.88 H4.2 46.99,53.98 45.69,52.67 45.69,50.83 43.85,50.83 43.18,50.17 43.18,31.32 44.09,30.41 44.95,30.41 45.65,29.71 45.65,28.85 46.63,27.87 48.26,27.87 48.26,10.85 47.57,10.16 46.86,10.16 46.8,10.09 46.01,10.09 45.65,9.74 45.65,7.69 45.72,7.62 ; 45.72,7.62 H4.21
GND: length 192
  Top Layer w0.254: 14.92,0.89 14,1.81 U16.6 14,3.91 13.3,4.61 ; LED1.2 8.39,68.36 3.5,68.36 ; U17.6 36.8,7.72 36.13,7.05 ; 40.82,35.8 40.82,37.95 ; 40.82,37.95 41.03,37.95 42.12,39.05 42.12,39.46 v1(40.89,40.7) 40.17,41.41 U4.1 ; 40.82,37.95 U4.7 ; v1(40.39,67.56) 40.39,69.15 C14.2 ; U18.9 45.72,66.04 v1(47.75,66.04) ; C13.1 36,8.89 35.53,8.42 35.53,7.85 35.69,7.7 35.48,7.7 ; 3.5,68.36 SW1.2 3.5,70.36 3.87,70.74 ; 3.5,68.36 SW2.2 3.5,63.33 3.81,63.01 H1.1 H2.1 ; 35.48,7.7 33.79,7.7 32.97,6.87 USB1.2 ; 35.48,7.7 36.13,7.05 ; USB1.A1B12 22.22,7.44 22.22,6.97 21.91,6.97 21.91,6.12 22.44,5.59 28.36,5.59 28.89,6.12 28.89,6.97 28.85,6.97 28.6,7.22 USB1.B1A12 ; USB1.A1B12 22.2,8.67 R3.1 22.11,9.33 21.67,9.77 21.67,10.33 22.11,10.77 22.52,10.77 22.92,11.18 23.36,11.18 ; USB1.A1B12 21.62,6.87 USB1.1 USB1.3 ; 12.1,5.81 12.1,7.14 11.86,7.38 10.56,7.38 10.29,7.65 10.29,13.38 10.63,13.72 13.34,13.72 D1.1 13.73,12.69 14.35,12.07 D2.1 ; H3.22 H4.22 ; 45.85,65.15 47.75,65.15 47.75,59.48 48.33,58.9 v1(48.87,58.9) ; USB1.2 29.15,7.44 USB1.B1A12 ; USB1.2 USB1.4 ; 37.5,5.68 36.13,7.05 ; 40.51,46.29 40.53,46.29 U5.1 40.76,44.67 41.66,43.78 41.66,43.48 41.95,43.19 v1(42,43.19) ; H1.22 H2.22 ; C1.2 16.65,70.42 U1.1 ; 18.92,9.53 19.49,10.09 19.49,12.07 ; v1(19.71,13.01) 19.71,12.54 19.49,12.32 ; C4.2 31.36,9.65 31.1,9.91 29.96,8.76 R4.1 28.69,7.54 USB1.B1A12 ; U16.13 15.7,5.86 ; U3.5 U3.6 41.39,28.43 U3.7 U3.8 ; 26.86,11.3 C8.2 ; 26.86,11.3 U2.2 ; 26.86,11.3 26.86,11.94 ; U1.41 U1.41 ; H4.1 H3.1
  Bottom Layer w0.254: v1(40.89,40.7) 40.89,43.14 41.28,43.53 ; 17.75,10.38 17.75,10.46 18.63,11.35 18.63,14.82 v1(19.3,15.49) ; 12.1,4.61 12.1,3.81 H2.22 ; v1(48.87,58.9) 48.74,58.9 H4.1 ; H3.22 44.45,3.98 43.35,5.08 39.3,5.08 38.7,4.48 ; 41.28,43.53 41.28,50.42 44.39,53.53 44.9,53.53 45.53,54.16 45.53,55.24 45.09,55.69 45.09,56.52 H3.1 ; 41.28,43.53 41.66,43.53 v1(42,43.19) ; v1(47.75,66.04) 47.44,66.04 45.91,67.56 v1(40.39,67.56) ; v1(19.3,16.26) 19.13,16.08 19.06,16.08 18.28,15.29 18.28,11.74 17.93,11.4 17.56,11.4 v1(17,10.84)
  vias: v1(11.68,65.79) v1(12.7,13.49) v1(15.55,10.62) v1(17.75,10.38) v1(18.92,9.58) v1(19.15,6.49) v1(20.62,61.42) v1(25.71,36.02) v1(25.71,30.94) v1(25.71,25.86) v1(25.71,20.78) v1(25.71,15.7) v1(30.78,41.1) v1(30.78,36.02) v1(30.78,30.94) v1(30.78,25.86) v1(30.78,20.78) v1(30.78,10.62) v1(31.8,4.19) v1(33.28,48.46) v1(35.87,66.5) v1(35.87,61.42) v1(40.94,56.34)
VBUS: length 12.6
  Top Layer w0.254: 29.35,9.91 29.6,9.91
  Top Layer w0.3: 23.14,7.39 23.14,6.58 23.19,6.53 ; USB1.B4A9 27.8,8.03 27.89,8.03 27.89,9.5 28.94,9.5 29.35,9.91
  Top Layer w0.4: USB1.B4A9 27.69,7.44 27.69,6.73 27.05,6.1 23.62,6.1 23.19,6.53
  Top Layer w0.5: D4.2 29.53,11.61 29.53,10.08 29.35,9.91
BOOT: length 117.4
  Top Layer w0.254: v1(28.63,58.17) 32.4,54.39 34.15,54.39 34.15,53.85 ; SW2.3 5.66,64.01 7.44,64.01 8.25,63.2 8.25,61.72 ; 8.25,61.72 9.8,61.72 9.8,67.1 10.06,67.35 10.06,70.26 10.41,70.61 ; 8.25,61.72 v1(8.25,50.93) ; v1(32.94,17.2) 32.94,15.79 33.23,15.5 35.82,15.5 35.82,15.49
  Bottom Layer w0.254: v1(28.63,58.17) 28.35,57.89 17.68,57.89 10.72,50.93 v1(8.25,50.93) 8.25,48.23 10.81,45.68 13.08,45.68 14.39,46.99 21.35,46.99 22.77,45.57 22.77,44.77 23.64,43.9 23.65,43.9 29.87,37.68 29.87,20.27 v1(32.94,17.2)
CC1: length 1.5
  Top Layer w0.254: R3.2 24.15,8.23 USB1.A5
CC2: length 1.3
  Top Layer w0.254: R4.2 27.19,7.48 USB1.B5
D+: length 62.2
  Top Layer w0.254: USB1.A6 25.22,7.37 25.22,6.75 25.38,6.59 25.92,6.59 26.08,6.75 26.08,7.37 USB1.B6 26.08,7.51 26.08,8.59 ; 16.65,53.85 16.65,47.16 v1(17.4,46.41) ; v1(20.7,17.81) 20.09,17.21 18.36,17.21 16.37,15.22 D2.2
  Bottom Layer w0.254: 17.4,46.41 17.4,46.11 20.41,43.1 20.41,18.1 v1(20.7,17.81) 22,17.81 25.29,14.52 25.5,14.52 25.5,14.25 26.08,13.67 26.08,8.59
  vias: v1(26.08,8.58)
D-: length 62
  Top Layer w0.254: 25.5,8.22 25.19,8.52 24.97,8.3 24.88,8.3 24.72,8.13 24.72,7.51 USB1.B7 ; v1(19.76,17.79) 18.44,17.79 16.02,15.37 16.02,14.12 D1.2 ; U1.13 16.16,55.12 15.62,54.58 15.62,47.18 v1(16.4,46.41) ; 25.58,8.13 25.58,7.51 USB1.A7
  Bottom Layer w0.254: 25.15,8.47 25.15,14.16 22.46,16.85 20.7,16.85 v1(19.76,17.79) 19.76,43.08 16.43,46.41 16.4,46.41 v1(16.4,46.41)
  vias: v1(25.15,8.58)
EN: length 67.9
  Top Layer w0.254: 11.07,67.33 11.07,67.32 R2.1 12.06,67.25 C3.1 15.62,67.25 15.62,67.28 16.65,67.28 U1.3 ; 11.07,67.33 11.05,67.35 11.05,71.18 10.89,71.34 9.49,71.34 ; 11.07,67.33 10.16,66.42 10.16,60.96 ; 5.65,70.87 5.65,69.64 ; 5.65,70.87 5.65,71.34 9.49,71.34 ; 5.65,70.87 C9.2 ; H2.11 5.25,32.86 5.25,50.46 5.77,50.99 7.43,50.99 7.43,51.05 v1(7.49,51.05) ; 10.16,60.96 10.29,60.83 v1(10.29,56.35) ; 10.16,60.96 R6.2 ; 9.49,71.34 9.49,67.45 5.66,67.45 5.66,65.61
  Bottom Layer w0.254: v1(10.29,56.35) 10.29,53.85 v1(7.49,51.05)
GPA0: length 45.7
  Top Layer w0.254: 13.35,8.08 13.35,10.66 v1(10.87,13.14)
  Bottom Layer w0.254: H1.4 3.81,48.52 5.27,47.06 5.27,44 6.28,42.99 6.8,42.99 7.43,42.36 7.43,40.82 10.14,38.12 10.14,13.87 v1(10.87,13.14)
GPA1: length 43.2
  Top Layer w0.254: v1(10.87,12.25) 12.7,10.42 12.7,8.08
  Bottom Layer w0.254: v1(10.87,12.25) 9.78,13.34 9.78,37.97 6.94,40.81 5.93,40.81 5.25,41.49 5.25,42.5 4.89,42.86 4.89,45.02 3.81,46.1 H1.5
GPA2: length 40.4
  Top Layer w0.254: 12.05,8.08 12.05,10.18 v1(10.87,11.36)
  Bottom Layer w0.254: v1(10.87,11.36) 9.42,12.81 9.42,37.82 6.8,40.45 5.78,40.45 4.89,41.34 4.89,42.36 3.81,43.44 H1.6
GPA3: length 37.9
  Top Layer w0.254: 11.4,8.08 11.4,8.36 11.46,8.36 11.46,9.88 v1(10.87,10.47)
  Bottom Layer w0.254: v1(10.87,10.47) 9.07,12.27 9.07,36.14 6.94,38.27 5.48,38.27 4.89,38.86 4.89,39.82 3.81,40.9 H1.7
GPA4: length 35.2
  Top Layer w0.254: v1(10.87,9.58) 10.87,8.2 10.75,8.08
  Bottom Layer w0.254: v1(10.87,9.58) 8.71,11.74 8.71,35.99 6.8,37.91 5.34,37.91 3.87,39.37 H1.8
GPA5: length 33.1
  Top Layer w0.254: v1(8.13,14.61) 8.13,8.6 9.57,7.16 U16.22
  Bottom Layer w0.254: H1.9 4.82,36.83 5.9,35.75 6.41,35.75 8.13,34.04 v1(8.13,14.61)
GPA6: length 34
  Top Layer w0.254: 9.6,6.48 8.25,6.48 6.94,7.79 3.39,7.79 2.73,8.44 2.73,33.21 H1.10
GPA7: length 32.6
  Top Layer w0.254: v1(2.15,30.1) 2.15,17.54 2.38,17.31 2.38,8.3 3.24,7.43 6.8,7.43 8.37,5.86 9.7,5.86
  Bottom Layer w0.254: H1.11 2.16,30.1 v1(2.15,30.1)
GPB0: length 32
  Top Layer w0.254: 9.57,5.21 3.43,5.21 2.73,5.9 2.73,7.44 2.02,8.15 2.02,17.16 1.79,17.39 1.79,26.95 v1(1.56,27.18)
  Bottom Layer w0.254: H1.12 1.78,27.18 v1(1.56,27.18)
GPB1: length 33.3
  Top Layer w0.254: U16.26 9.13,4.56 7.14,2.56 3.06,2.56 2.38,3.25 2.38,7.29 1.66,8 1.66,16.67 v1(1.41,16.92)
  Bottom Layer w0.254: v1(1.41,16.92) 1.41,17.15 1.9,17.64 1.9,22.72 2.73,23.55 2.73,24.58 3.81,25.66 H1.13
GPB2: length 31.3
  Top Layer w0.254: v1(1.05,11.43) 1.31,11.18 1.31,7.85 2.02,7.14 2.02,3.1 2.92,2.21 7.28,2.21 8.98,3.91 U16.27
  Bottom Layer w0.254: H1.14 2.26,22.58 2.26,17.49 1.99,17.23 1.99,15.21 1.64,14.85 1.64,12.82 1.05,12.24 v1(1.05,11.43)
GPB3: length 30
  Top Layer w0.254: v1(0.61,10.17) 0.61,8.05 1.66,6.99 1.66,2.96 2.77,1.85 7.43,1.85 8.84,3.26 9.7,3.26
  Bottom Layer w0.254: H1.15 2.61,20.39 2.61,17.34 2.35,17.08 2.35,15.04 1.99,14.69 1.99,12.65 1.64,12.29 1.64,10.28 1.53,10.17 v1(0.61,10.17)
GPB4: length 27.9
  Top Layer w0.254: v1(0.87,3.19) 1.22,2.85 1.27,2.85 2.62,1.5 10.16,1.5 10.75,2.08
  Bottom Layer w0.254: H1.16 3.81,18.04 2.73,16.96 2.73,14.92 2.38,14.56 2.38,12.53 2.02,12.17 2.02,10.14 0.87,8.99 v1(0.87,3.19)
GPB5: length 27.2
  Top Layer w0.254: 11.4,2.08 11.4,1.84 10.7,1.14 2.47,1.14 1.35,2.26 v1(0.9,2.26)
  Bottom Layer w0.254: H1.17 3.81,15.5 2.73,14.42 2.73,12.38 2.38,12.02 2.38,9.99 1.23,8.84 1.23,3.77 1.46,3.55 1.46,2.72 1,2.26 v1(0.9,2.26)
GPB6: length 26.1
  Top Layer w0.254: v1(1.04,1.14) 1.3,1.14 1.38,1.22 1.86,1.22 1.94,1.14 1.97,1.14 2.33,0.78 11.11,0.78 12.05,1.72 12.05,2.08
  Bottom Layer w0.254: H1.18 3.81,12.96 2.73,11.88 2.73,9.84 1.59,8.7 1.59,3.92 1.81,3.69 1.81,2.28 1.04,1.5 v1(1.04,1.14)
GPB7: length 24
  Top Layer w0.254: v1(1.62,0.64) 1.94,0.64 2.15,0.43 11.4,0.43 12.7,1.72 12.7,2.08
  Bottom Layer w0.254: H1.19 3.81,10.42 1.94,8.55 1.94,4.07 2.17,3.84 2.17,1.81 1.62,1.26 v1(1.62,0.64)
GPC0: length 62.6
  Top Layer w0.254: U17.17 37.47,2.08 v1(37.47,1.24) ; H4.4 49.49,47.03 49.49,1.67 48.66,0.83 41.64,0.83 v1(41.41,0.6)
  Bottom Layer w0.254: v1(41.41,0.6) 41.23,0.43 38.28,0.43 v1(37.47,1.24)
GPC1: length 58.4
  Top Layer w0.254: U17.18 38.1,1.72 39.16,0.67 40.65,0.67 41.17,1.19 48.51,1.19 49.14,1.81 49.14,44.84 H4.5
GPC2: length 54.2
  Top Layer w0.254: H4.6 48.78,42.66 48.78,1.96 48.36,1.54 40.91,1.54 40.39,1.02 39.56,1.02 38.75,1.84 U17.19
GPC3: length 50.2
  Top Layer w0.254: H4.7 48.43,40.48 48.43,2.11 48.22,1.9 40.76,1.9 40.24,1.38 39.86,1.38 39.4,1.84 U17.20
GPC4: length 45.8
  Top Layer w0.254: U17.21 40.23,1.91 40.23,1.91 40.58,2.26 48.07,2.26 48.07,38.29 H4.8
GPC5: length 44.8
  Top Layer w0.254: v1(42.19,3.25) 42.06,3.13 U17.22
  Bottom Layer w0.254: v1(42.19,3.25) 42.59,2.85 42.59,2.44 43.01,2.02 48.2,2.02 48.78,2.6 48.78,7.63 50.12,8.97 50.12,33.7 H4.9
GPC6: length 41.9
  Top Layer w0.254: v1(42.72,3.81) 42.66,3.81 42.63,3.84 41.94,3.84 41.89,3.78 U17.23
  Bottom Layer w0.254: H4.10 49.76,31.52 49.76,9.12 48.43,7.78 48.43,2.75 48.05,2.38 43.16,2.38 42.95,2.59 42.95,3.58 v1(42.72,3.81)
GPC7: length 40.2
  Top Layer w0.254: v1(43.11,4.5) 41.17,4.5 U17.24
  Bottom Layer w0.254: H4.11 48.82,31.75 49.41,31.16 49.41,9.27 48.07,7.93 48.07,2.89 47.91,2.73 43.31,2.73 43.31,3.57 43.3,3.58 43.3,4.3 v1(43.11,4.5)
GPD0: length 31
  Top Layer w0.254: 45.91,25.65 45.89,25.68 45.89,28.11 H4.12 ; U17.25 41.46,5.08 42.51,6.14 42.51,14.69 40.29,16.92 39.93,16.92 v1(39.88,16.97)
  Bottom Layer w0.254: v1(46.11,25.65) 46.11,25.28 45.56,24.72 45.56,23.71 44.52,22.67 44,22.67 43.31,21.97 43.31,19.94 43.02,19.64 43.02,17.61 42.88,17.48 40.39,17.48 v1(39.88,16.97)
GPD1: length 27.7
  Top Layer w0.254: U17.26 41.46,5.73 42.16,6.43 42.16,14.49 40.5,16.15 39.93,16.15 v1(39.88,16.21)
  Bottom Layer w0.254: H4.13 46.99,25.21 46.54,25.21 45.91,24.58 45.91,22.54 45.56,22.18 45.56,21.17 44.52,20.13 44,20.13 43.37,19.5 43.37,17.46 42.12,16.21 v1(39.88,16.21)
GPD2: length 24.2
  Top Layer w0.254: U17.27 41.46,6.38 41.8,6.72 41.8,14.35 40.7,15.44 v1(39.88,15.44)
  Bottom Layer w0.254: v1(39.88,15.44) 41.86,15.44 44,17.59 44.52,17.59 45.56,18.63 45.56,19.69 45.91,20.04 45.91,22.04 46.54,22.67 46.99,22.67 H4.14
GPD3: length 19.7
  Top Layer w0.254: U17.28 41.44,7.38 41.44,13.88 v1(40.64,14.68)
  Bottom Layer w0.254: H4.15 46.99,20.58 45.91,19.5 45.91,17.52 45.56,17.17 45.56,16.09 44.87,15.41 43.86,15.41 43.13,14.68 v1(40.64,14.68)
GPD4: length 17.2
  Top Layer w0.254: v1(39.56,13.16) 40.01,13.16 40.05,13.12 U17.1
  Bottom Layer w0.254: v1(39.56,13.16) 39.35,13.16 39.26,13.25 42.2,13.25 44,15.05 45.02,15.05 45.91,15.94 45.91,17.02 46.99,18.1 H4.16
GPD5: length 15.2
  Top Layer w0.254: v1(39.15,12.49) 39.15,11.85 39.22,11.78 39.22,8.26 U17.2
  Bottom Layer w0.254: H4.17 46.99,15.62 45.91,14.54 45.91,13.39 45.41,12.89 40.96,12.89 40.56,12.49 v1(39.15,12.49)
GPD6: length 12.8
  Top Layer w0.254: v1(38.56,11.66) 38.56,11.34 38.76,11.14 38.76,8.31 38.75,8.3
  Bottom Layer w0.254: v1(38.56,11.66) 38.58,11.66 38.61,11.68 40.26,11.68 41.11,12.54 45.56,12.54 H4.18
GPD7: length 12.3
  Top Layer w0.254: 38.17,10.88 38.17,8.15 U17.4
  Bottom Layer w0.254: H4.19 46.3,10.74 45.92,10.74 45.53,10.35 42.99,10.35 42.6,10.74 40.62,10.74 40.48,10.88 38.17,10.88
  vias: v1(38.18,10.9)
GPIO4: length 41.9
  Top Layer w0.254: H2.12 12.57,35.43 v1(12.57,41.4) ; U1.4 16.33,66.55 12.46,62.68 12.46,43.17 v1(12.57,43.05)
  Bottom Layer w0.254: v1(12.57,41.4) v1(12.57,43.05)
GPIO5: length 45.4
  Top Layer w0.254: U1.5 16.29,65.28 12.93,61.92 12.93,47.17 15.05,45.06 15.05,43.79 14.48,43.23 13.51,43.23 v1(13.34,43.05) ; H2.13 13.34,33.66 v1(13.34,41.4)
  Bottom Layer w0.254: v1(13.34,41.4) v1(13.34,43.05)
GPIO6: length 46.3
  Top Layer w0.254: U1.6 16.29,64.01 13.28,61.01 13.28,47.32 15.4,45.2 15.4,43.6 14.4,42.6 v1(14.1,42.6) ; v1(14.1,41.4) 14.1,31.88 H2.14
  Bottom Layer w0.254: v1(14.1,41.4) v1(14.1,42.6)
GPIO7: length 47.7
  Top Layer w0.254: v1(14.86,41.43) 14.86,30.1 H2.15 ; U1.7 16.33,62.74 13.64,60.06 13.64,47.47 15.76,45.35 15.76,43.92 v1(15.99,43.69)
  Bottom Layer w0.254: 15.88,43.69 15.52,43.69 14.86,43.03 v1(14.86,41.43)
GPIO8: length 43.9
  Top Layer w0.254: v1(16.37,42.95) 16.57,43.16 16.57,43.93 16.11,44.39 16.11,45.5 14,47.62 14,54.06 16.33,56.39 U1.12 ; v1(16.03,41.43) 15.62,41.02 15.62,28.32 H2.16
  Bottom Layer w0.254: v1(16.37,42.95) 16.37,41.78 16.26,41.67 16.26,41.66 v1(16.03,41.43)
GPIO9: length 42.2
  Top Layer w0.254: 20.96,52.57 20.96,48.26 17.53,44.84 v1(17.53,42.95) ; v1(16.84,41.43) 16.84,41 16,40.16 16,36.93 15.98,36.93 15.98,35.76 16,35.76 16,26.16 H2.17
  Bottom Layer w0.254: v1(16.84,41.43) 17.53,42.12 17.53,42.25 17.53,42.26 v1(17.53,42.95)
GPIO10: length 46.2
  Top Layer w0.254: 22.22,52.57 21.68,52.57 21.68,51.54 21.31,51.54 21.31,48.12 18.3,45.1 v1(18.3,42.95) ; v1(17.93,41.12) 16.36,39.55 16.36,26.01 7.43,17.09 7.43,16.06 6.35,14.98 H2.18
  Bottom Layer w0.254: v1(17.93,41.12) 18.14,41.33 18.14,43.21 18.3,43.05 v1(18.3,42.95)
GPIO11: length 49.8
  Top Layer w0.254: H2.19 7.77,12.85 7.77,14.02 7.54,14.02 7.54,15.19 7.83,15.19 7.83,16.98 16.71,25.87 16.71,39.05 v1(18.69,41.03) ; v1(19.06,42.95) 19.06,45.36 21.67,47.97 21.67,51.19 22.04,51.19 22.04,51.54 22.95,51.54 22.95,52.57 23.5,52.57
  Bottom Layer w0.254: v1(18.69,41.03) 19.06,41.39 v1(19.06,42.95)
GPIO12: length 38.1
  Top Layer w0.254: v1(24.77,55.12) 24.77,52.57
  Bottom Layer w0.254: H3.12 44.07,29.21 42.57,30.71 42.57,36.4 30.2,48.78 30.2,51.83 26.91,55.12 v1(24.77,55.12)
GPIO13: length 40.9
  Top Layer w0.254: v1(26.03,49.28) v1(26.03,54.48) ; H3.13 42.92,26.67 42.05,25.8 39.4,25.8 39.4,26.01 39.14,26.26 39.14,26.67 38.25,27.56 v1(38.25,36.45)
  Bottom Layer w0.254: v1(26.03,49.28) 26.03,48.26 28.03,46.26 28.03,44.59 28.72,43.9 30.8,43.9 v1(38.25,36.45)
GPIO14: length 38.8
  Top Layer w0.254: v1(27.31,53.9) 27.31,52.57
  Bottom Layer w0.254: H3.14 43.4,24.13 40.77,26.76 40.77,37.71 29.84,48.63 29.84,51.36 v1(27.31,53.9)
GPIO15: length 57.3
  Top Layer w0.254: U1.8 16.97,61.47 20.32,58.13 v1(20.32,53.78) ; v1(42.16,20.13) 42.99,20.13 H3.15
  Bottom Layer w0.254: v1(42.16,20.13) 40.41,21.88 40.41,37.56 24.19,53.78 v1(20.32,53.78)
GPIO16: length 56.8
  Top Layer w0.254: U1.9 16.97,60.2 19.56,57.62 v1(19.56,53.78) ; v1(41.66,19.49) 44.01,19.49 H3.16
  Bottom Layer w0.254: v1(19.56,53.78) 19.56,53.45 19.81,53.2 24.27,53.2 40.06,37.41 40.06,21.09 v1(41.66,19.49)
GPIO17: length 57.6
  Top Layer w0.254: v1(18.8,53.78) 18.8,57.11 16.97,58.93 16.65,58.93 ; H3.17 43.37,17.59 42.12,17.59 41.28,18.43 41.28,18.72 v1(41.15,18.86)
  Bottom Layer w0.254: v1(18.8,53.78) 18.8,53.41 19.36,52.84 24.12,52.84 39.7,37.26 39.7,20.3 v1(41.15,18.86)
GPIO18: length 58.6
  Top Layer w0.254: v1(18.03,53.78) 18.03,56.6 16.97,57.66 U1.11 ; H3.18 44.45,14.92 42.14,17.23 41.78,17.23 40.79,18.22 40.7,18.22
  Bottom Layer w0.254: v1(40.64,18.22) 39.34,19.52 39.34,37.12 23.98,52.48 18.91,52.48 18.03,53.36 v1(18.03,53.78)
GPIO21: length 50
  Top Layer w0.254: v1(39.8,18.23) 39.8,17.9 43.37,14.34 43.37,12.89 44.45,12.89 H3.19 ; 28.58,52.57 28.58,48.17 28.38,47.98 v1(27.52,47.98)
  Bottom Layer w0.254: v1(27.52,47.98) 27.98,47.98 30.39,45.57 30.39,45.54 38.99,36.94 38.99,19.05 v1(39.8,18.23)
JOIN1: length 7.6
  Top Layer w0.254: H3.4 H3.5 H3.6 H3.7
JOIN2: length 7.6
  Top Layer w0.254: H3.11 H3.10 H3.9 H3.8
LRBJ: length 43.6
  Bottom Layer w0.254: H2.21 6.35,6.73 6.83,7.21 19.37,7.21 19.73,6.84 19.73,6.56 20.91,5.38 30.21,5.38 34.89,10.06 36.17,10.06 36.58,9.65 41.62,9.65 41.62,8.7 43.97,6.35 H3.21
LRTJ: length 49.7
  Bottom Layer w0.254: H2.2 7.73,54.61 18.78,65.66 33.29,65.66 36.73,62.22 36.73,57.97 37.77,56.93 42.13,56.93 H3.2
MTCK: length 33.7
  Top Layer w0.254: v1(29.21,60.2) 34.15,60.2 U1.32 ; v1(11.3,50.67) 11.3,50.5 11.02,50.5 10.06,49.53 H2.4
  Bottom Layer w0.254: v1(29.21,60.2) 29.21,57.92 28.82,57.53 18.44,57.53 11.58,50.67 v1(11.3,50.67)
MTDI: length 38.2
  Top Layer w0.254: v1(11.3,49.15) 11.05,49.15 H2.6 ; U1.34 v1(30.73,62.74)
  Bottom Layer w0.254: v1(11.3,49.15) 11.62,49.15 15.8,53.33 15.8,53.88 18.74,56.82 29.11,56.82 30.73,58.44 v1(30.73,62.74)
MTDO: length 35.9
  Top Layer w0.254: H2.5 8.02,46.99 10.94,49.91 v1(11.3,49.91) ; U1.33 v1(29.97,61.47)
  Bottom Layer w0.254: v1(11.3,49.91) 11.62,49.91 15.44,53.73 15.44,54.03 18.59,57.18 28.96,57.18 29.97,58.18 v1(29.97,61.47)
MTMS: length 41.4
  Top Layer w0.254: H2.7 7.53,43.09 7.53,44.97 10.94,48.39 v1(11.3,48.39) ; v1(31.5,63.63) 33.76,63.63 U1.35
  Bottom Layer w0.254: v1(31.5,63.63) 31.5,58.7 29.26,56.46 18.88,56.46 16.15,53.73 16.15,52.92 11.62,48.39 v1(11.3,48.39)
PWRLED: length 4.3
  Top Layer w0.254: LED1.1 9.01,66.13 9.01,62.36
RX: length 44.3
  Top Layer w0.254: H2.8 8.13,41.15 8.13,44.58 11.18,47.63 v1(11.3,47.63) ; U1.36 33.61,64.74 33.28,64.74 32.8,64.26 v1(32.26,64.26)
  Bottom Layer w0.254: v1(11.3,47.63) 11.62,47.63 16.51,52.51 16.51,53.59 19.03,56.11 29.41,56.11 32.26,58.96 v1(32.26,64.26)
SCK: length 109
  Top Layer w0.254: 38.53,56.34 38.36,56.34 v1(38.36,56.35) 38.53,56.35 38.53,56.34 ; 38.53,56.34 38.52,56.33 38.52,55.99 38.7,55.81 38.7,37.95 37.67,36.92 37.67,21.93 38.34,21.26 38.34,20.88 38.52,20.7 38.52,15.97 v1(40.66,13.83) ; 38.53,56.34 v1(38.53,58.12) ; 34.04,7.03 33.46,6.45 32.1,6.45 30.5,4.86 30.5,1.8 30.24,1.54 20.72,1.54 19.13,3.13 15.7,3.13 ; 34.04,7.03 v1(34.04,7.11) ; 34.04,7.03 U17.8 ; v1(41.58,66.04) 41.71,65.91 41.71,64.43 43.68,62.46 45.79,62.46 45.79,61.73 46.48,61.73 46.48,59.48 ; v1(35.22,9.04) 35.22,10.64 35.47,10.89 35.53,10.89 35.53,11.22 36.05,11.74 ; 34.15,58.93 v1(35.31,58.93)
  Bottom Layer w0.254: v1(35.22,9.04) 34.88,9.04 34.04,8.19 v1(34.04,7.11) ; v1(41.58,66.04) 39.92,66.04 39.87,65.99 38.52,65.99 37.94,65.41 37.94,65.05 37.9,65.01 37.9,64.8 37.81,64.71 37.81,58.64 38.33,58.12 v1(38.53,58.12) ; v1(40.66,13.83) 40.58,13.74 38.78,13.74 37.01,11.97 36.28,11.97 v1(36.05,11.74) ; v1(35.31,58.93) 36.38,57.86 36.38,57.82 37.85,56.35 v1(38.36,56.35)
  vias: v1(37.94,65.05)
SCL: length 122.4
  Top Layer w0.254: 39.94,59.96 40.39,59.96 40.39,59.5 39.94,59.96 ; 39.94,59.96 39.93,59.96 39.93,59.97 ; 39.94,59.96 39.93,59.97 ; v1(31.88,16.64) 32.15,16.36 32.15,16.08 33.12,15.11 33.12,14.77 33.92,13.97 R8.1 ; 39.88,60.02 39.88,51.56 43.25,48.19 43.25,44.2 42.47,44.2 U5.3 ; 39.88,60.02 39.88,60.2 v1(39.7,60.2) 39.88,60.02 ; 39.88,60.02 39.93,59.97 ; v1(24.13,42.6) 24.36,42.83 25.45,42.83 25.63,43 28.8,43 30.39,44.59 30.39,47.28 36.6,53.49 36.6,57.84 39.26,60.5 39.93,60.5 39.93,59.97 ; 29.84,52.57 29.84,48.94 26.67,45.76 U6.3 ; 42.6,43.85 42.6,41.77 42.12,41.77 42.12,40.61 42.94,39.79 42.94,27.19 41.9,26.16 39.75,26.16 39.5,26.41 39.5,26.67 39.51,26.68
  Bottom Layer w0.254: v1(24.13,42.6) 29.52,37.21 29.52,19 v1(31.88,16.64) ; v1(39.7,60.2) 42.31,62.8 42.24,62.87 v1(40.05,62.87) ; 27.31,42.93 27.31,45.08 U6.3
  vias: v1(27.31,42.91)
SDA: length 104.4
  Top Layer w0.254: 31.12,52.57 31.22,52.47 v1(31.22,50.42) ; 40.66,43.85 41.28,43.22 41.28,41.96 U4.3 41.47,40.61 42.17,39.92 42.31,39.92 42.58,39.65 42.58,27.34 41.93,26.68 U3.4 ; v1(21.59,42.24) 21.82,42.01 25.63,42.01 v1(26.03,42.42) ; v1(39.7,61.09) 39.47,61.32 39.47,61.09 39.34,61.09 36.25,57.99 36.25,53.69 31.54,48.98 v1(31.22,48.98) 30.9,48.98 29.21,47.3 U6.4 27.62,43.5 25.41,43.5 25.09,43.18 22.48,43.18 21.31,42.01 12.79,42.01 11.99,42.81 11.99,53.82 9.7,56.1 9.7,58.74 R9.1
  Bottom Layer w0.254: 31.22,50.42 v1(31.22,48.98) 31.22,48.26 41.51,37.97 v1(42.36,37.97) ; v1(39.7,63.88) 39.47,63.65 39.47,61.32 v1(39.7,61.09)
SDI: length 115.3
  Top Layer w0.254: v1(34.95,8.28) 34.54,8.68 34.54,12.09 32.39,14.25 32.39,15.34 32.23,15.49 v1(31.88,15.49) ; U1.26 v1(32.39,51.31) ; 47.75,70.83 47.75,68.58 46.13,66.95 v1(45.7,66.95) ; v1(37.21,17.15) 35.75,18.6 35.75,35.51 38.34,38.1 38.34,45.42 36.96,46.8 36.96,57.37 38.34,58.76 38.4,58.76 v1(38.52,58.88) ; v1(16.64,3.71) 16.57,3.78 15.7,3.78 ; v1(36.96,50.8) 36.96,47.63 ; U17.9 35.04,6.31 v1(34.29,6.31) ; v1(16.64,2.55) 19.21,2.55 20.58,1.18 30.39,1.18 30.86,1.65 30.86,4.71 32.24,6.1 34.2,6.1
  Bottom Layer w0.254: v1(36.96,50.8) 32.89,50.8 v1(32.39,51.31) ; v1(16.64,2.55) v1(16.64,3.71) ; v1(38.51,64.47) 38.52,64.47 ; 38.52,64.47 38.55,64.47 38.55,65.29 38.9,65.63 39.72,65.63 39.98,65.38 44.12,65.38 v1(45.7,66.95) ; 38.52,64.47 38.52,58.88 ; v1(31.88,15.49) 35.56,15.49 v1(37.21,17.15) ; v1(34.29,6.31) 34.62,6.64 34.62,7.95 v1(34.95,8.28)
SDO: length 135.9
  Top Layer w0.254: v1(15.44,42.67) 15.75,42.37 16.95,42.37 ; v1(17.4,1.96) 19.29,1.96 20.43,0.83 30.54,0.83 31.21,1.5 31.21,4.56 32.38,5.73 U17.10 ; v1(40.41,64.26) 40.62,64.26 40.64,64.24 40.64,63.58 40.92,63.58 41.12,63.38 41.12,61.55 40.39,61.55 40.39,60.42 40.28,60.31 40.28,61.67 39.12,61.67 39.12,61.44 38.99,61.44 38.99,61.23 35.89,58.14 35.89,53.84 31.89,49.84 31.24,49.84 28.03,46.62 28.03,44.77 27.13,43.87 25.28,43.87 24.95,43.54 22.06,43.54 20.89,42.37 16.95,42.37 ; 17.4,4.43 17.4,4.57 17.96,5.13 18.61,5.13 19.81,6.33 19.81,6.69 18.33,8.16 18.33,10.62 17.69,11.26 v1(17.69,11.98) ; 17.4,4.43 17.32,4.51 15.78,4.51 ; 17.4,4.43 v1(17.4,3.71) ; 16.95,42.37 16.95,44.76 19.69,47.5 19.69,52.57 ; v1(42.29,64.8) 42.29,64.9 43.97,66.58 44.33,66.58 46.48,68.74 46.48,70.83
  Bottom Layer w0.254: 19.22,17.17 19.09,17.17 17.79,15.87 17.79,11.98 v1(17.69,11.98) ; 19.22,17.17 15.44,20.94 v1(15.44,42.67) ; 19.22,17.17 20.07,16.32 v1(20.07,15.49) ; v1(17.4,3.71) v1(17.4,1.96) ; v1(40.41,64.26) 41.75,64.26 v1(42.29,64.8)
ST_CS: length 23.3
  Top Layer w0.254: v1(39.29,58.12) 39.29,56.39 v1(39.24,56.35) ; 45.21,60.37 45.21,59.48 U18.2 ; 45.21,60.37 v1(41.58,60.37) ; 45.21,60.37 45.21,61.73 ; U1.29 v1(35.31,56.39)
  Bottom Layer w0.254: v1(39.24,56.35) 39.24,56.26 38.74,55.76 35.94,55.76 v1(35.31,56.39) ; 39.11,59.48 39.11,65.03 v1(39.14,65.05) ; 39.11,59.48 39.11,58.29 v1(39.29,58.12) ; 39.11,59.48 39.25,59.61 39.94,59.61 40.69,60.37 v1(41.58,60.37)
TBLJ: length 44.4
  Top Layer w0.254: H2.20 4.89,10.35 4.89,50.61 H2.3
TBRJ: length 44.1
  Top Layer w0.254: H3.20 45.53,9.97 45.53,50.99 H3.3
TX: length 48.2
  Top Layer w0.254: U1.37 33.61,66.01 33.28,66.01 32.39,65.11 v1(32.39,65.08) ; H2.9 11.3,41.78 v1(11.3,46.86)
  Bottom Layer w0.254: v1(11.3,46.86) 11.62,46.86 16.87,52.11 16.87,53.44 19.18,55.75 29.55,55.75 33.02,59.22 33.02,64.44 v1(32.39,65.08)
X_CS: length 78.6
  Top Layer w0.254: 14.65,2.08 16.05,2.08 16.76,1.38 19.37,1.38 20.28,0.47 30.68,0.47 31.57,1.35 31.57,1.74 31.8,1.97 v1(31.8,2.03) ; U17.7 36.34,8.27 36.34,8.51 36.65,8.82 v1(36.65,9.04) 36.65,9.43 36.68,9.43 36.68,11.87 36.63,11.92 36.63,16.56 36.63,16.56 36.63,17.19 35.4,18.42 35.4,37.63 35.4,37.63 v1(35.4,51.47) ; U1.28 34.15,55.12 v1(35.31,55.12)
  Bottom Layer w0.254: v1(31.8,2.03) 31.86,2.03 32.38,2.55 32.38,7.04 34.96,9.62 35.52,9.62 36.11,9.04 v1(36.65,9.04) ; v1(35.31,55.12) 35.4,55.02 v1(35.4,51.47)
XRES: length 21.4
  Top Layer w0.254: v1(31.8,2.79) 32.04,2.79 32.38,3.13 U17.14 ; U16.14 15.74,7.11 16.24,7.11 v1(16.86,6.49)
  Bottom Layer w0.254: v1(16.86,6.49) 16.86,6.38 18.05,5.19 18.94,5.19 20.18,3.95 30.32,3.95 31.48,2.79 v1(31.8,2.79)

## Copper pours and planes (outline as drawn; the poured copper is in the pictures)
GND on Top Layer: 0,71.88 50.8,71.88 50.8,0 0,0
GND on Bottom Layer: 0,71.88 50.8,71.88 50.8,0 0,0

## Text on the board
Bottom Silkscreen Layer: YTK-DE1 v1 | "Everything Board"
Top Silkscreen Layer: ENABLE | BOOT | PWR | ^ | > | < | Board | Everything | YTK-DE1 v1 | MTCK | MTDO | MTDI | MTMS | A0 | A1 | A2 | A3 | A4 | A5 | A6 | A7 | B0 | B1 | B2 | B3 | B4 | B5 | B6 | B7 | GND | 5V | 3V3 | RX | TX | NC | EN | 4 | 5 | 6 | 7 | 8 | 9 | 10 | 11 | 12 | 13 | 14 | 15 | 16 | 17 | 18 | 21 | C0 | C1 | C2 | C3 | C4 | C5 | C6 | C7 | D0 | D1 | D2 | D3 | D4 | D5 | D6 | D7
